# Altium project NumPad_20200816.PrjPcb
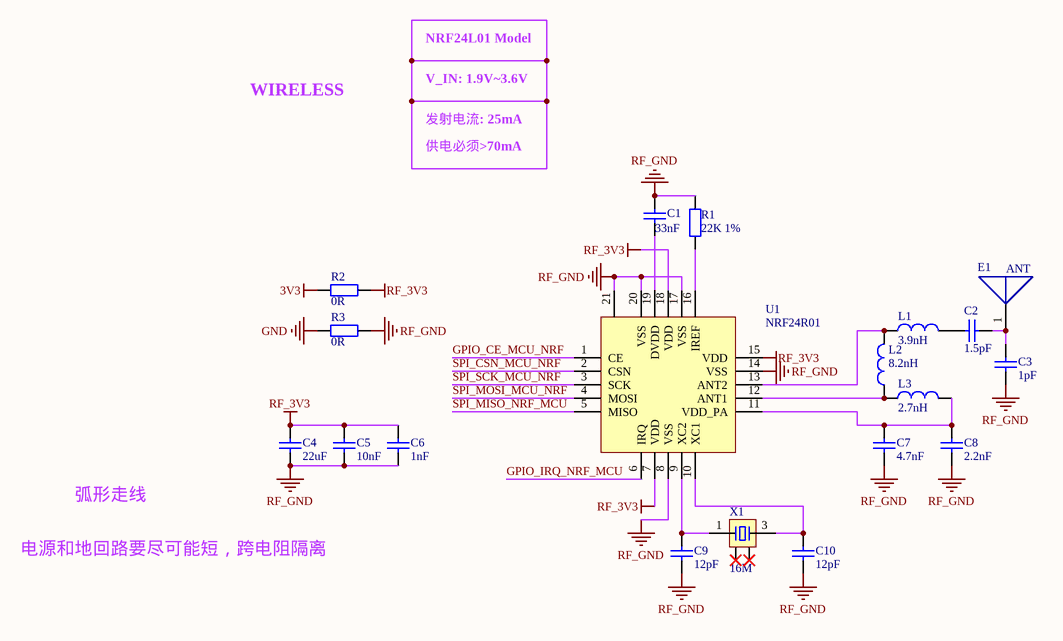
[diagram p0: NRF24L01.SchDoc]
5 sheets, 124 parts. Net scope: global (net labels, ports and power ports of the same name join across sheets).
Board files: NumPad.PcbDoc, 定位板.PcbDoc
Sheets:
  NRF24L01.SchDoc
  MCU.SchDoc
  KEY_Pad.SchDoc
  LED.SchDoc
  POWER.SchDoc

## Sheet NRF24L01.SchDoc
size A4

### Parts
C1  33nF  [Cap-0603]
C2  1.5pF  [Cap-0402]
C3  1pF  [Cap-0402]
C4  22uF  [Cap-0805]
C5  10nF  [Cap-0603]
C6  1nF  [Cap-0603]
C7  4.7nF  [Cap-0402]
C8  2.2nF  [Cap-0402]
C9  12pF  [Cap-0603]
C10  12pF  [Cap-0603]
E1  ANT  [AN2051-245]
L1  3.9nH  [L-0402]
L2  8.2nH  [L-0402]
L3  2.7nH  [L-0402]
R1  22K 1%  [Res-0603]
R2  0R  [Res-0603]
R3  0R  [Res-0603]
U1  NRF24R01  [QFN20 4x4]
X1  16M  [OSC 3225-4P]

### Nets
3V3: R2.1
GND: R3.1
RF_3V3: C4.1 C5.2 C6.2 R2.2 U1.7(VDD) U1.15(VDD) U1.18(VDD)
RF_GND: C1.1 C3.1 C4.2 C5.1 C6.1 C7.1 C8.1 C9.1 C10.1 R1.1 R3.2 U1.8(VSS) U1.14(VSS) U1.17(VSS) U1.20(VSS) U1.21
GPIO_CE_MCU_NRF: U1.1(CE)
GPIO_IRQ_NRF_MCU: U1.6(IRQ)
SPI_CSN_MCU_NRF: U1.2(CSN)
SPI_MISO_NRF_MCU: U1.5(MISO)
SPI_MOSI_MCU_NRF: U1.4(MOSI)
SPI_SCK_MCU_NRF: U1.3(SCK)
NetC1_2: C1.2 U1.19(DVDD)
NetC2_1: C2.1 L1.2
NetC2_2: C2.2 C3.2 E1.1
NetC7_2: C7.2 C8.2 L3.2 U1.11(VDD_PA)
NetC9_2: C9.2 U1.9(XC2) X1.1
NetC10_2: C10.2 U1.10(XC1) X1.3
NetL1_1: L1.1 L2.2 U1.13(ANT2)
NetL2_1: L2.1 L3.1 U1.12(ANT1)
NetR1_2: R1.2 U1.16(IREF)

Not connected (* = marked no-connect by the designer): X1 2* 4*

### Notes on the sheet
- NRF24L01 Model
- WIRELESS
- V_IN: 1.9V~3.6V
- 发射电流: 25mA
- 供电必须>70mA
- 弧形走线
- 电源和地回路要尽可能短，跨电阻隔离

### Library data of the parts
C1-C10 = CAP: 贴片陶瓷电容
L1-L3 = INDUCTOR: 贴片电感
R1-R3 = RES: 贴片电阻
U1 = NRF24R01: 2.4G无线
X1 = XTAL-4P: 4脚无源晶振
E1 = ANT: Published: 12-August-2017; Publisher: mazhongwei; PackageReference: R_1206

## Sheet MCU.SchDoc
size A4
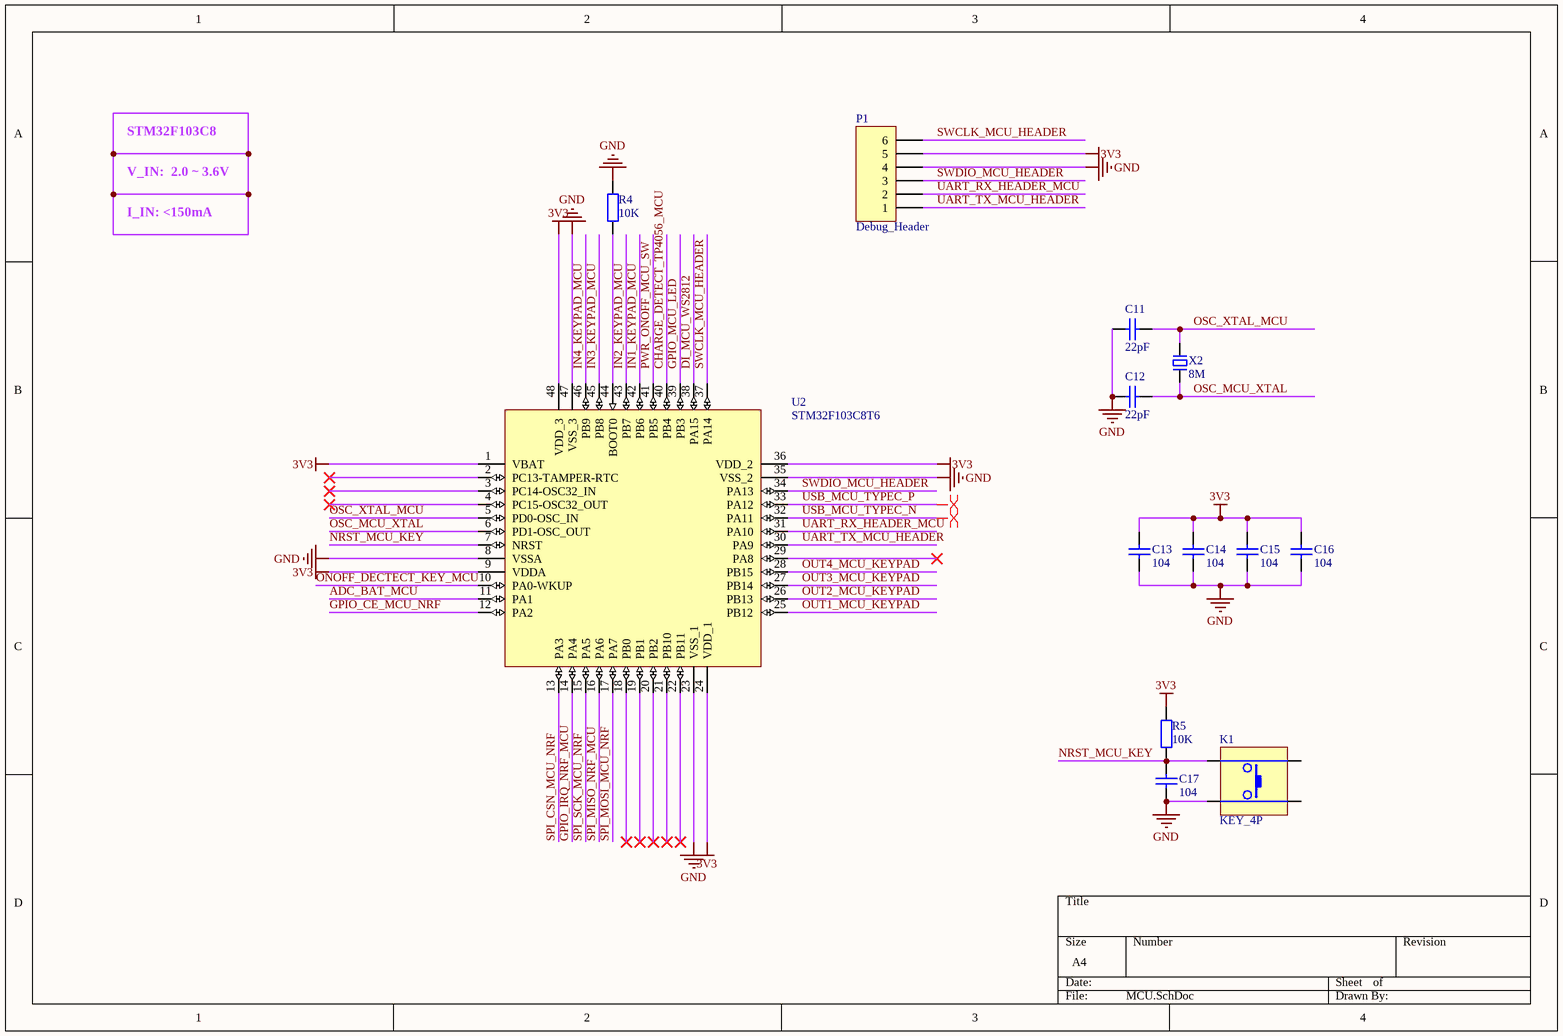
[diagram p1: MCU.SchDoc]

### Parts
C11  22pF  [Cap-0603]
C12  22pF  [Cap-0603]
C13  104  [Cap-0603]
C14  104  [Cap-0603]
C15  104  [Cap-0603]
C16  104  [Cap-0603]
C17  104  [Cap-0603]
K1  KEY_4P  [SW-SMD-3X4X2.5]
P1  Debug_Header  [Header 2.54X6]
R4  10K  [Res-0603]
R5  10K  [Res-0603]
U2  STM32F103C8T6  [STM32F103C8T6]
X2  8M  [OSC 5032-2P]

### Nets
3V3: C13.2 C14.2 C15.2 C16.2 P1.5 R5.2 U2.1(VBAT) U2.9(VDDA) U2.24(VDD_1) U2.36(VDD_2) U2.48(VDD_3)
GND: C11.1 C12.1 C13.1 C14.1 C15.1 C16.1 C17.1 K1.4 P1.4 R4.2 U2.8(VSSA) U2.23(VSS_1) U2.35(VSS_2) U2.47(VSS_3)
ADC_BAT_MCU: U2.11(PA1)
CHARGE_DETECT_TP4056_MCU: U2.40(PB4)
DI_MCU_WS2812: U2.38(PA15)
GPIO_CE_MCU_NRF: U2.12(PA2)
GPIO_IRQ_NRF_MCU: U2.14(PA4)
GPIO_MCU_LED: U2.39(PB3)
IN1_KEYPAD_MCU: U2.42(PB6)
IN2_KEYPAD_MCU: U2.43(PB7)
IN3_KEYPAD_MCU: U2.45(PB8)
IN4_KEYPAD_MCU: U2.46(PB9)
NRST_MCU_KEY: C17.2 K1.3 R5.1 U2.7(NRST)
ONOFF_DECTECT_KEY_MCU: U2.10(PA0-WKUP)
OSC_MCU_XTAL: C12.2 U2.6(PD1-OSC_OUT) X2.1
OSC_XTAL_MCU: C11.2 U2.5(PD0-OSC_IN) X2.2
OUT1_MCU_KEYPAD: U2.25(PB12)
OUT2_MCU_KEYPAD: U2.26(PB13)
OUT3_MCU_KEYPAD: U2.27(PB14)
OUT4_MCU_KEYPAD: U2.28(PB15)
PWR_ONOFF_MCU_SW: U2.41(PB5)
SPI_CSN_MCU_NRF: U2.13(PA3)
SPI_MISO_NRF_MCU: U2.16(PA6)
SPI_MOSI_MCU_NRF: U2.17(PA7)
SPI_SCK_MCU_NRF: U2.15(PA5)
SWCLK_MCU_HEADER: P1.6 U2.37(PA14)
SWDIO_MCU_HEADER: P1.3 U2.34(PA13)
UART_RX_HEADER_MCU: P1.2 U2.31(PA10)
UART_TX_MCU_HEADER: P1.1 U2.30(PA9)
USB_MCU_TYPEC_N: U2.32(PA11)
USB_MCU_TYPEC_P: U2.33(PA12)
NetR4_1: R4.1 U2.44(BOOT0)

Not connected (* = marked no-connect by the designer): K1 1 2; U2 2(PC13-TAMPER-RTC)* 3(PC14-OSC32_IN)* 4(PC15-OSC32_OUT)* 18(PB0)* 19(PB1)* 20(PB2)* 21(PB10)* 22(PB11)* 29(PA8)*

### Layout directives
differential pair: USB_MCU_TYPEC_N, USB_MCU_TYPEC_P

### Notes on the sheet
- STM32F103C8
- V_IN:  2.0～3.6V
- I_IN: <150mA

### Library data of the parts
C11-C17 = CAP: 贴片陶瓷电容
P1 = Header_6
R4 R5 = RES: 贴片电阻
U2 = STM32F103C8T6: ARM Cortex-M3 32-bit MCU, 64 KB Flash, 20 KB Internal RAM, 37 I/Os, 48-pin LQFP, -40 to 85 degC, Tray; A/D Converter: 2x12-bit (10 Channel); FLASH Size (Prog) (kB): 64; I/Os (High Current): 37; Internal RAM Size (kB): 20; Operating Frequency(F) (Processor speed) (MHz): 72; Supply Voltage(Vcc) min (V): 2; DatasheetVersion: Rev. 16; PackageVersion: Rev. 6, 06/2013; PackageReference: LQFP48; PackageDescription: 48-Pin Low Profile Quad Flat Package, 7 x 7 mm Body, 0.5 mm Pitch; Supplier 1: Digi-Key; Supplier Part Number 1: 497-6063-ND; Supplier 2: Farnell; Supplier Part Number 2: 1447637; Supplier 3: Newark; Supplier Part Number 3: 59M2182; Supplier 4: Newark; Supplier Part Number 4: 57P1222; Supplier 5: Mouser; Supplier Part Number 5: 511-STM32F103C8T6; Core: ARM Cortex-M3; Packing: Tray; Mounting Technology: Surface Mount; PartNumber: STM32F103C8T6; ComponentLink1Description: Manufacturer URL; ComponentLink1URL: http://www.st.com/web/en/home.html; ComponentLink2Description: Datasheet; ComponentLink2URL: http://www.st.com/st-web-ui/static/active/en/resource/technical/document/datasheet/CD00161566.pdf; ComponentLink3Description: Package Specification; ComponentLink3URL: http://www.st.com/st-web-ui/static/active/en/resource/technical/document/datasheet/DM00058181.pdf
X2 = XTAL-2P: 2脚无源脚晶振

## Sheet KEY_Pad.SchDoc
size A4
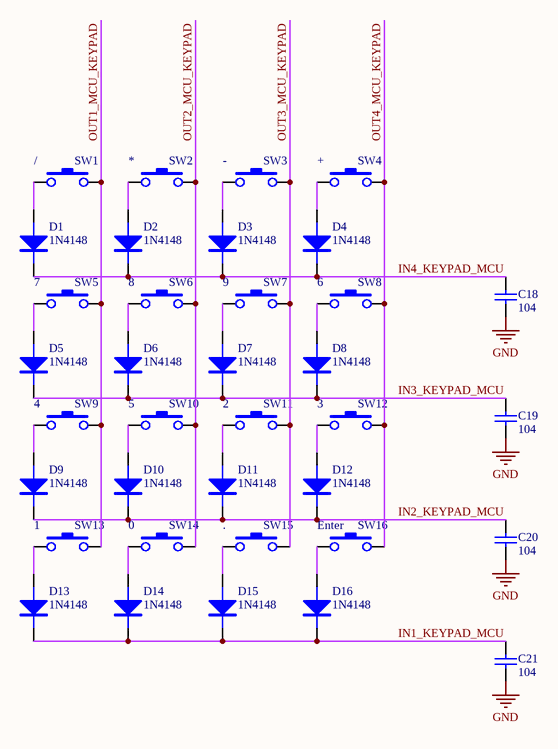
[diagram p2: KEY_Pad.SchDoc]

### Parts
C18  104  [Cap-0603]
C19  104  [Cap-0603]
C20  104  [Cap-0603]
C21  104  [Cap-0603]
D1  1N4148  [SOD-523]
D2  1N4148  [SOD-523]
D3  1N4148  [SOD-523]
D4  1N4148  [SOD-523]
D5  1N4148  [SOD-523]
D6  1N4148  [SOD-523]
D7  1N4148  [SOD-523]
D8  1N4148  [SOD-523]
D9  1N4148  [SOD-523]
D10  1N4148  [SOD-523]
D11  1N4148  [SOD-523]
D12  1N4148  [SOD-523]
D13  1N4148  [SOD-523]
D14  1N4148  [SOD-523]
D15  1N4148  [SOD-523]
D16  1N4148  [SOD-523]
SW1  /  [MX_SW-4]
SW2  *  [MX_SW-4]
SW3  -  [MX_SW-4]
SW4  +  [MX_SW-4]
SW5  7  [MX_SW-4]
SW6  8  [MX_SW-4]
SW7  9  [MX_SW-4]
SW8  6  [MX_SW-4]
SW9  4  [MX_SW-4]
SW10  5  [MX_SW-4]
SW11  2  [MX_SW-4]
SW12  3  [MX_SW-4]
SW13  1  [MX_SW-4]
SW14  0  [MX_SW-4]
SW15  .  [MX_SW-4]
SW16  Enter  [MX_SW-4]

### Nets
GND: C18.2 C19.2 C20.1 C21.1
IN1_KEYPAD_MCU: C21.2 D13.K D14.K D15.K D16.K
IN2_KEYPAD_MCU: C20.2 D9.K D10.K D11.K D12.K
IN3_KEYPAD_MCU: C19.1 D5.K D6.K D7.K D8.K
IN4_KEYPAD_MCU: C18.1 D1.K D2.K D3.K D4.K
OUT1_MCU_KEYPAD: SW1.2 SW5.2 SW9.2 SW13.2
OUT2_MCU_KEYPAD: SW2.2 SW6.2 SW10.2 SW14.2
OUT3_MCU_KEYPAD: SW3.2 SW7.2 SW11.2 SW15.2
OUT4_MCU_KEYPAD: SW4.2 SW8.2 SW12.2 SW16.2
NetD1_A: D1.A SW1.1
NetD2_A: D2.A SW2.1
NetD3_A: D3.A SW3.1
NetD4_A: D4.A SW4.1
NetD5_A: D5.A SW5.1
NetD6_A: D6.A SW6.1
NetD7_A: D7.A SW7.1
NetD8_A: D8.A SW8.1
NetD9_A: D9.A SW9.1
NetD10_A: D10.A SW10.1
NetD11_A: D11.A SW11.1
NetD12_A: D12.A SW12.1
NetD13_A: D13.A SW13.1
NetD14_A: D14.A SW14.1
NetD15_A: D15.A SW15.1
NetD16_A: D16.A SW16.1

### Library data of the parts
C18-C21 = CAP: 贴片陶瓷电容
D1-D16 = DIODE: 普通二极管
SW1-SW16 = MX_SW-4: with Fixation pins  1-Pole

## Sheet LED.SchDoc
size A4
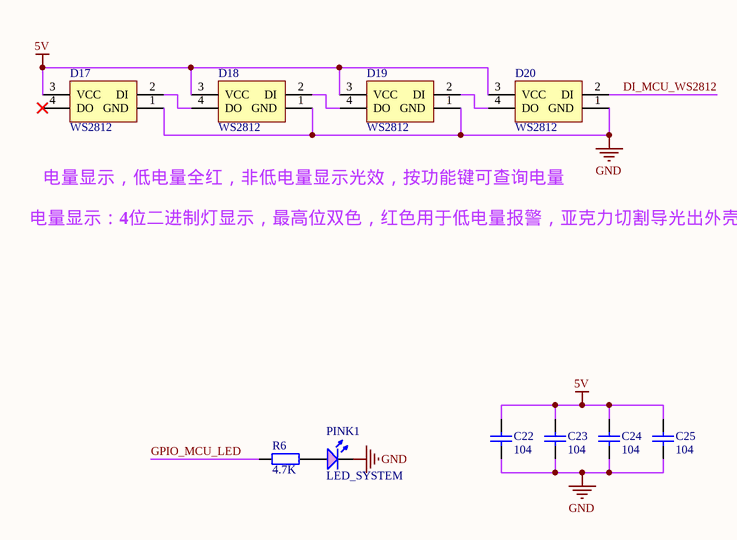
[diagram p3: LED.SchDoc]

### Parts
C22  104  [Cap-0603]
C23  104  [Cap-0603]
C24  104  [Cap-0603]
C25  104  [Cap-0603]
D17  WS2812  [RGB_LED_1206]
D18  WS2812  [RGB_LED_1206]
D19  WS2812  [RGB_LED_1206]
D20  WS2812  [RGB_LED_1206]
PINK1  LED_SYSTEM  [LED_0603_R]
R6  4.7K  [Res-0603]

### Nets
5V: C22.2 C23.2 C24.2 C25.2 D17.3(VCC) D18.3(VCC) D19.3(VCC) D20.3(VCC)
GND: C22.1 C23.1 C24.1 C25.1 D17.1(GND) D18.1(GND) D19.1(GND) D20.1(GND) PINK1.2(K)
DI_MCU_WS2812: D20.2(DI)
GPIO_MCU_LED: R6.2
NetD17_2: D17.2(DI) D18.4(DO)
NetD18_2: D18.2(DI) D19.4(DO)
NetD19_2: D19.2(DI) D20.4(DO)
NetPINK1_1: PINK1.1(A) R6.1

Not connected (* = marked no-connect by the designer): D17 4(DO)*

### Notes on the sheet
- 电量显示，低电量全红，非低电量显示光效，按功能键可查询电量
- 电量显示：4位二进制灯显示，最高位双色，红色用于低电量报警，亚克力切割导光出外壳，为了易看放于朝向人那面
- Title
- Size:
- Date:
- A4
- Number:
- Time:
- Revision:
- Sheet
- of
- File:

### Library data of the parts
C22-C25 = CAP: 贴片陶瓷电容
PINK1 = LED_SMD_PINK: 发光二极管; ComponentLink1Description: 供应商链接; ComponentLink1URL: http://www.szlcsc.com/product/details_2659.html; Package: 0603; Supplier: LC; SuppliersPartNumber: C2286
R6 = RES: 贴片电阻
D17-D20 = WS2812: Publisher: mazhongwei; Published: 8-August-2017; PackageReference: RGB_LED_5050

## Sheet POWER.SchDoc
size A4
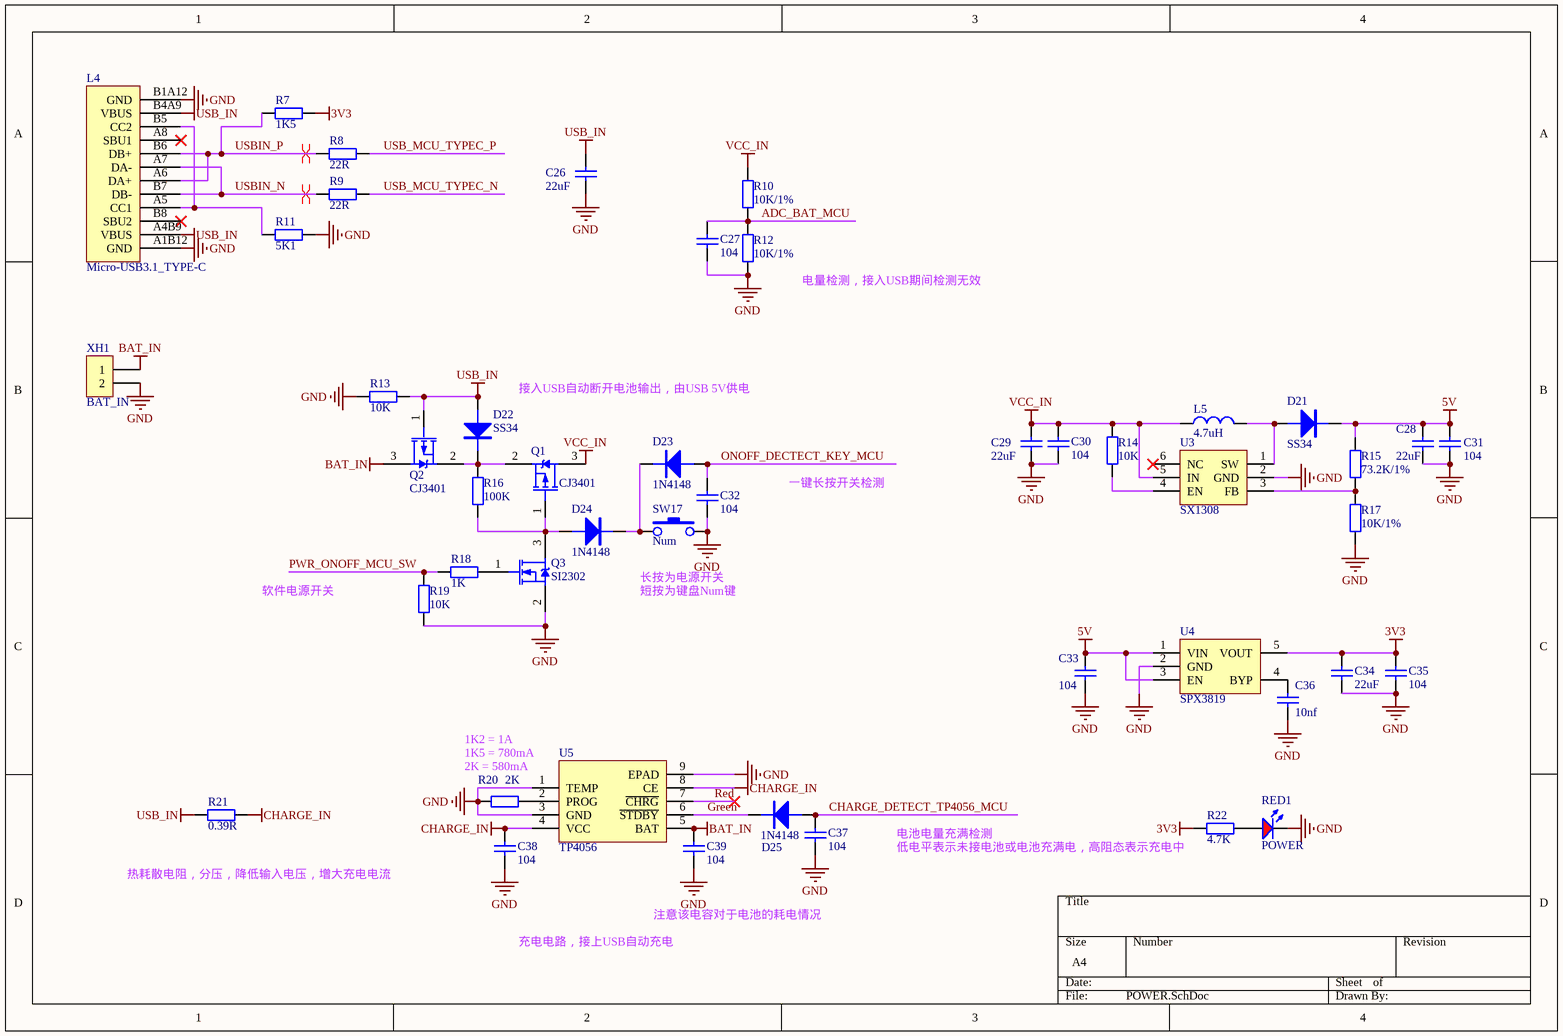
[diagram p4: POWER.SchDoc]

### Parts
C26  22uF  [Cap-0805]
C27  104  [Cap-0603]
C28  22uF  [Cap-0805]
C29  22uF  [Cap-0805]
C30  104  [Cap-0603]
C31  104  [Cap-0603]
C32  104  [Cap-0603]
C33  104  [Cap-0603]
C34  22uF  [Cap-0805]
C35  104  [Cap-0603]
C36  10nf  [Cap-0603]
C37  104  [Cap-0603]
C38  104  [Cap-0603]
C39  104  [Cap-0603]
D21  SS34  [Doide-SMA]
D22  SS34  [Doide-SMA]
D23  1N4148  [SOD-523]
D24  1N4148  [SOD-523]
D25  1N4148  [SOD-523]
L4  Micro-USB3.1_TYPE-C  [USB3.0-TYPEC-12P]
L5  4.7uH  [L-MHC0603]
Q1  CJ3401  [SOT23-3]
Q2  CJ3401  [SOT23-3]
Q3  SI2302  [SOT23-3]
R7  1K5  [Res-0603]
R8  22R  [Res-0603]
R9  22R  [Res-0603]
R10  10K/1%  [Res-0603]
R11  5K1  [Res-0603]
R12  10K/1%  [Res-0603]
R13  10K  [Res-0603]
R14  10K  [Res-0603]
R15  73.2K/1%  [Res-0603]
R16  100K  [Res-0603]
R17  10K/1%  [Res-0603]
R18  1K  [Res-0603]
R19  10K  [Res-0603]
R20  2K  [Res-0603]
R21  0.39R  [Res-1812]
R22  4.7K  [Res-0603]
RED1  POWER  [LED_0603_R]
SW17  Num  [MX_SW-4]
U3  SX1308  [SX1308]
U4  SPX3819  [SOT23-5]
U5  TP4056  [TP4056]
XH1  BAT_IN  [XH2/2.54mm/180]

### Nets
3V3: C34.2 C35.1 R7.1 R22.2 U4.5(VOUT)
5V: C28.2 C31.2 C33.2 D21.K R15.2 U4.1(VIN) U4.3(EN)
BAT_IN: C39.2 Q2.3(D) U5.5(BAT) XH1.1
CHARGE_IN: C38.2 R21.2 U5.4(VCC) U5.8(CE)
GND: C26.1 C27.1 C28.1 C29.1 C30.1 C31.1 C32.2 C33.1 C34.1 C35.2 C36.1 C37.1 C38.1 C39.1 L4.A1B12(GND) L4.B1A12(GND) Q3.2(S) R11.1 R12.1 R13.2 R17.1 R19.2 R20.2 RED1.2(K) SW17.2 U3.2(GND) U4.2(GND) U5.1(TEMP) U5.3(GND) U5.9(EPAD) XH1.2
USB_IN: C26.2 D22.A L4.A4B9(VBUS) L4.B4A9(VBUS) Q2.1(G) R13.1 R21.1
VCC_IN: C29.2 C30.2 L5.2 Q1.3(D) R10.2 R14.1 U3.5(IN)
ADC_BAT_MCU: C27.2 R10.1 R12.2
CHARGE_DETECT_TP4056_MCU: C37.2 D25.A
Green: D25.K U5.6(~{STDBY})
ONOFF_DECTECT_KEY_MCU: C32.1 D23.A
PWR_ONOFF_MCU_SW: R18.1 R19.1
Red: U5.7(~{CHRG})
USB_MCU_TYPEC_N: R9.1
USB_MCU_TYPEC_P: R8.1
USBIN_N: L4.A7(DA-) L4.B7(DB-) R9.2
USBIN_P: L4.A6(DA+) L4.B6(DB+) R7.2 R8.2
NetC36_2: C36.2 U4.4(BYP)
NetD21_A: D21.A L5.1 U3.1(SW)
NetD22_K: D22.K Q1.2(S) Q2.2(S) R16.1
NetD23_K: D23.K D24.K SW17.1
NetD24_A: D24.A Q1.1(G) Q3.3(D) R16.2
NetL4_A5: L4.A5(CC1) L4.B5(CC2) R11.2
NetQ3_1: Q3.1(G) R18.2
NetR14_2: R14.2 U3.4(EN)
NetR15_1: R15.1 R17.2 U3.3(FB)
NetR20_1: R20.1 U5.2(PROG)
NetR22_1: R22.1 RED1.1(A)

Not connected (* = marked no-connect by the designer): L4 A8(SBU1)* B8(SBU2)*; U3 6(NC)*

### Layout directives
differential pair: USBIN_N, USBIN_P

### Notes on the sheet
- 电量检测，接入USB期间检测无效
- 接入USB自动断开电池输出，由USB 5V供电
- 一键长按开关检测
- 长按为电源开关
- 软件电源开关
- 短按为键盘Num键
- 1K2 = 1A
- 1K5 = 780mA
- 2K = 580mA
- 电池电量充满检测
- 低电平表示未接电池或电池充满电，高阻态表示充电中
- 热耗散电阻，分压，降低输入电压，增大充电电流
- 注意该电容对于电池的耗电情况
- 充电电路，接上USB自动充电

### Library data of the parts
C26-C35 C37-C39 = CAP: 贴片陶瓷电容
C36 = Cap
D21-D25 = DIODE: 普通二极管
L5 = INDUCTOR-SMD: 贴片屏蔽电感
Q1 Q2 = MOSFET-P2: P-Channel MOSFET; PackageDocument: 1995/1996; Published: 8-Jun-2000; LatestRevisionDate: 17-Jul-2002; LatestRevisionNote: Re-released for DXP Platform.; PackageReference: E3; Publisher: Altium Limited
Q3 = MOSFET-N2: N-Channel MOSFET; PackageDocument: 1995/1996; Published: 8-Jun-2000; LatestRevisionDate: 17-Jul-2002; LatestRevisionNote: Re-released for DXP Platform.; PackageReference: E3; Publisher: Altium Limited
R7-R22 = RES: 贴片电阻
RED1 = LED_SMD_RED: 发光二极管; ComponentLink1Description: 供应商链接; ComponentLink1URL: http://www.szlcsc.com/product/details_2659.html; Package: 0603; Supplier: LC; SuppliersPartNumber: C2286
SW17 = MX_SW-4: with Fixation pins  1-Pole
XH1 = XH2

## Nets that join several sheets
3V3: NRF24L01 (R2.1), MCU (11 pins), POWER (5 pins)
5V: LED (8 pins), POWER (7 pins)
GND: NRF24L01 (R3.1), MCU (14 pins), KEY_Pad (C18.2 C19.2 C20.1 C21.1), LED (9 pins), POWER (31 pins)
ADC_BAT_MCU: MCU (U2.11), POWER (C27.2 R10.1 R12.2)
CHARGE_DETECT_TP4056_MCU: MCU (U2.40), POWER (C37.2 D25.A)
DI_MCU_WS2812: MCU (U2.38), LED (D20.2)
GPIO_CE_MCU_NRF: NRF24L01 (U1.1), MCU (U2.12)
GPIO_IRQ_NRF_MCU: NRF24L01 (U1.6), MCU (U2.14)
GPIO_MCU_LED: MCU (U2.39), LED (R6.2)
IN1_KEYPAD_MCU: MCU (U2.42), KEY_Pad (5 pins)
IN2_KEYPAD_MCU: MCU (U2.43), KEY_Pad (5 pins)
IN3_KEYPAD_MCU: MCU (U2.45), KEY_Pad (5 pins)
IN4_KEYPAD_MCU: MCU (U2.46), KEY_Pad (5 pins)
ONOFF_DECTECT_KEY_MCU: MCU (U2.10), POWER (C32.1 D23.A)
OUT1_MCU_KEYPAD: MCU (U2.25), KEY_Pad (SW1.2 SW5.2 SW9.2 SW13.2)
OUT2_MCU_KEYPAD: MCU (U2.26), KEY_Pad (SW2.2 SW6.2 SW10.2 SW14.2)
OUT3_MCU_KEYPAD: MCU (U2.27), KEY_Pad (SW3.2 SW7.2 SW11.2 SW15.2)
OUT4_MCU_KEYPAD: MCU (U2.28), KEY_Pad (SW4.2 SW8.2 SW12.2 SW16.2)
PWR_ONOFF_MCU_SW: MCU (U2.41), POWER (R18.1 R19.1)
SPI_CSN_MCU_NRF: NRF24L01 (U1.2), MCU (U2.13)
SPI_MISO_NRF_MCU: NRF24L01 (U1.5), MCU (U2.16)
SPI_MOSI_MCU_NRF: NRF24L01 (U1.4), MCU (U2.17)
SPI_SCK_MCU_NRF: NRF24L01 (U1.3), MCU (U2.15)
USB_MCU_TYPEC_N: MCU (U2.32), POWER (R9.1)
USB_MCU_TYPEC_P: MCU (U2.33), POWER (R8.1)